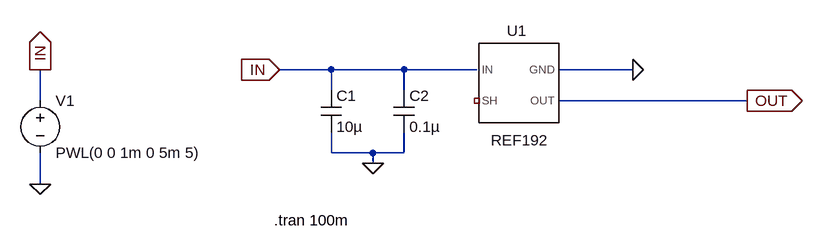
[diagram p0: schematic example_ref192.asc]
example_ref192.asc, the LTspice schematic file:
Version 4.1
SHEET 1 880 680
WIRE -48 160 -128 160
WIRE 64 160 -48 160
WIRE 176 160 64 160
WIRE 416 160 304 160
WIRE -48 192 -48 160
WIRE 64 192 64 160
WIRE -496 208 -496 160
WIRE 592 208 304 208
WIRE -48 288 -48 256
WIRE 16 288 -48 288
WIRE 64 288 64 256
WIRE 64 288 16 288
WIRE 16 304 16 288
WIRE -496 336 -496 288
FLAG 416 160 0
FLAG -128 160 IN
IOPIN -128 160 In
FLAG 592 208 OUT
IOPIN 592 208 Out
FLAG 16 304 0
FLAG -496 336 0
FLAG -496 160 IN
IOPIN -496 160 Out
SYMBOL REF192 240 176 R0
SYMATTR InstName U1
SYMBOL cap -64 192 R0
SYMATTR InstName C1
SYMATTR Value 10µ
SYMBOL cap 48 192 R0
SYMATTR InstName C2
SYMATTR Value 0.1µ
SYMBOL voltage -496 192 R0
WINDOW 123 0 0 Left 0
WINDOW 39 0 0 Left 0
SYMATTR InstName V1
SYMATTR Value PWL(0 0 1m 0 5m 5)
TEXT -136 392 Left 2 !.tran 100m

The netlist it stands for:
* example_ref192.asc
X§U1 IN NC_01 0 OUT REF192  ; pins IN SH GND OUT
C1 IN 0 10µ
C2 IN 0 0.1µ
V1 IN 0 PWL(0 0 1m 0 5m 5)
.tran 100m
.lib C:\Users\Jacky\Desktop\LT_Learn\Thirdpartylib\REF192\ref192.cir
.backanno
.end

* Results of the author's LTspice run, read from the files saved beside the schematic
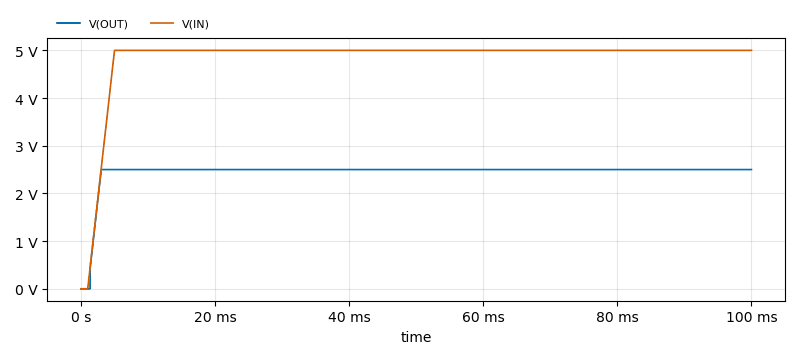
[diagram p1: Transient Analysis of example_ref192.asc, plotted from the saved traces]
* Transient Analysis, 1 run:
*   V(OUT): min 0 V, max 2.5 V, average 2.449 V, rms 2.471 V, last 2.5 V
*   V(IN): min 0 V, max 5 V, average 4.85 V, rms 4.908 V, last 5 V